# Altium project uCurrentRev5.PrjPcb
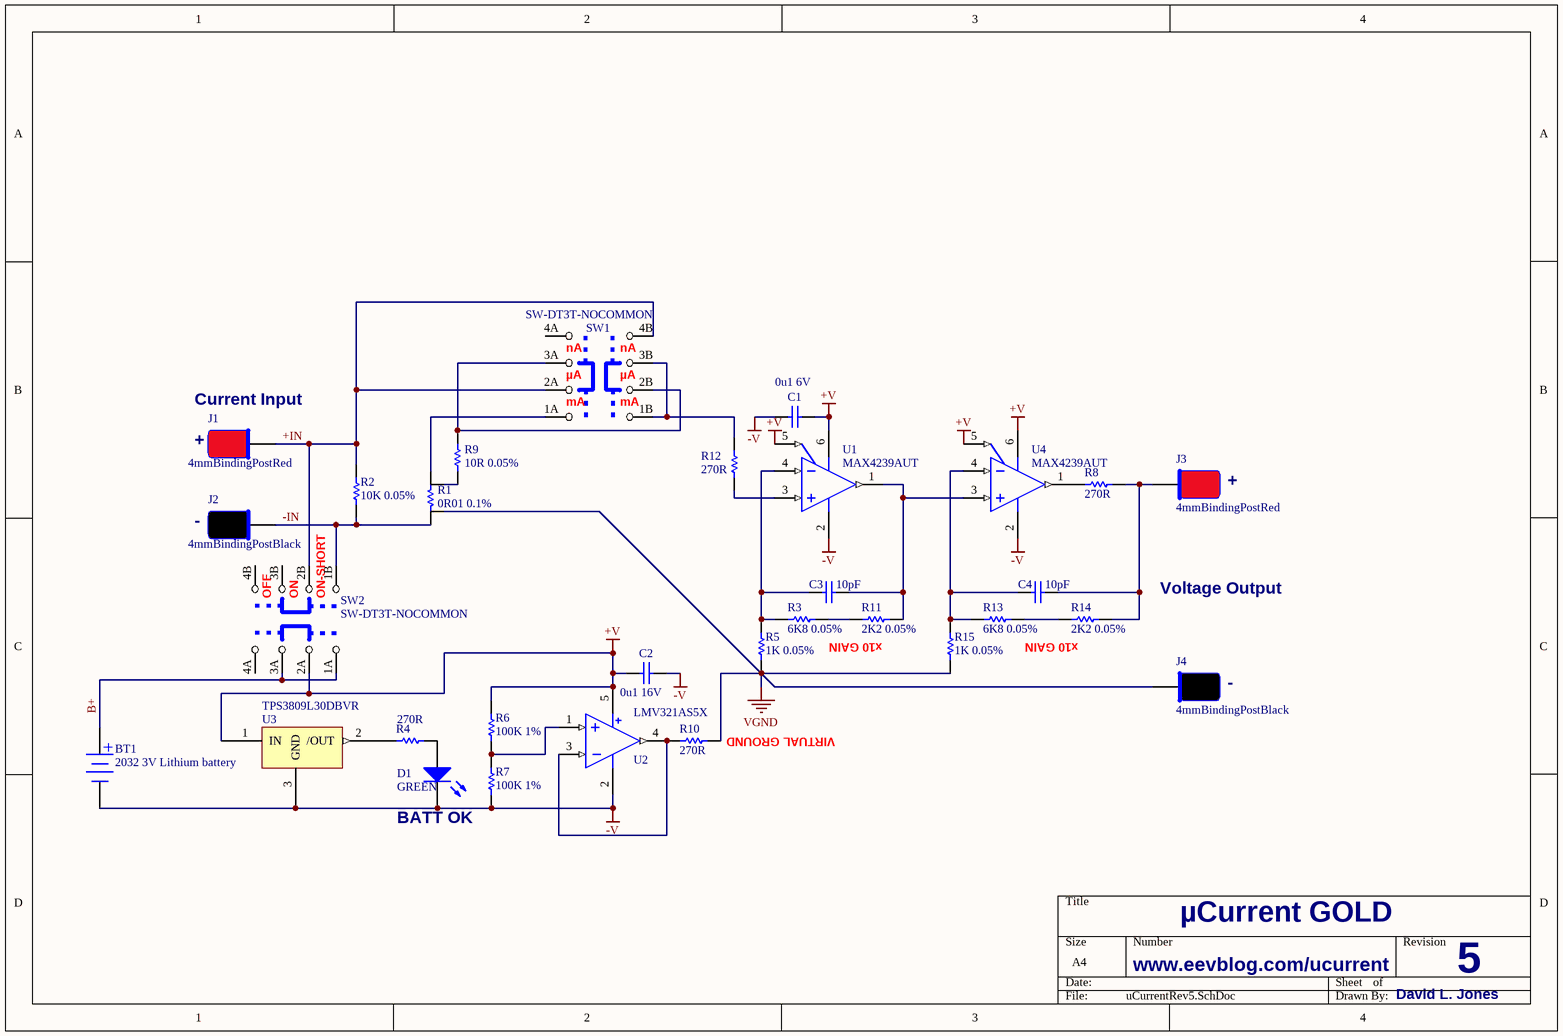
[diagram p0: uCurrentRev5.SchDoc]
1 sheet, 31 parts. Net scope: global (net labels, ports and power ports of the same name join across sheets).
Board files: uCurrentPanelRev5.PcbDoc, uCurrentRev5.PcbDoc

## Sheet uCurrentRev5.SchDoc
size A4

### Parts
BT1  2032 3V Lithium battery  [2032 SMD Holder]
C1  0u1 6V  [CAPC1608N]
C2  0u1 16V  [CAPC1608N]
C3  10pF  [CAPC1608N]
C4  10pF  [CAPC1608N]
D1  GREEN  [1206reverseLED]
J1  4mmBindingPostRed  [4mmBindingPost]
J2  4mmBindingPostBlack  [4mmBindingPost]
J3  4mmBindingPostRed  [4mmBindingPost]
J4  4mmBindingPostBlack  [4mmBindingPost]
R1  0R01 0.1%  [2512shuntresistor]
R2  10K 0.05%  [RESC1608N]
R3  6K8 0.05%  [RESC1608N]
R4  270R  [RESC1608N]
R5  1K 0.05%  [RESC1608N]
R6  100K 1%  [RESC1608N]
R7  100K 1%  [RESC1608N]
R8  270R  [RESC1608N]
R9  10R 0.05%  [RESC2012N]
R10  270R  [RESC1608N]
R11  2K2 0.05%  [RESC1608N]
R12  270R  [RESC1608N]
R13  6K8 0.05%  [RESC1608N]
R14  2K2 0.05%  [RESC1608N]
R15  1K 0.05%  [RESC1608N]
SW1  SW-DT3T-NOCOMMON  [SW_L203011MS02]
SW2  SW-DT3T-NOCOMMON  [SW_L203011MS02]
U1  MAX4239AUT  [SOT-23-CH6_N]
U2  LMV321AS5X  [SOT23-5AL]
U3  TPS3809L30DBVR  [SOT23]
U4  MAX4239AUT  [SOT-23-CH6_N]

### Nets
+V: C1.2 C2.1 R6.2 SW2.2A U1.5(~{CS}) U1.6(VDD) U2.5(V+) U3.1(IN) U4.5(~{CS}) U4.6(VDD)
-V: BT1.2(-) C1.1 C2.2 D1.2(K) R7.2 U1.2(VSS) U2.2 U3.3(GND) U4.2(VSS)
VGND: J4.1(NOISE) R1.4 R5.2 R10.1 R15.2
+IN: J1.1(NOISE) R2.1 SW1.2A SW1.4B SW2.2B(2A)
-IN: J2.1(NOISE) R1.2 R2.2 SW2.1B
B+: BT1.1(+) SW2.1A SW2.3A
NetC3_1: C3.1 R3.1 R5.1 U1.4(VIN-)
NetC3_2: C3.2 R11.2 U1.1(VOUT) U4.3(VIN+)
NetC4_1: C4.1 R13.1 R15.1 U4.4(VIN-)
NetC4_2: C4.2 J3.1(NOISE) R8.1 R14.2
NetD1_1: D1.1(A) R4.1
NetR1_1: R1.1 SW1.1A
NetR1_3: R1.3 R9.2
NetR3_2: R3.2 R11.1
NetR4_2: R4.2 U3.2(/OUT)
NetR6_1: R6.1 R7.1 U2.1(IN+)
NetR8_2: R8.2 U4.1(VOUT)
NetR9_1: R9.1 SW1.2B(2A) SW1.3A
NetR10_2: R10.2 U2.3(IN-) U2.4(OUT)
NetR12_1: R12.1 SW1.1B SW1.3B
NetR12_2: R12.2 U1.3(VIN+)
NetR13_2: R13.2 R14.1

Not connected (* = marked no-connect by the designer): SW1 4A; SW2 3B 4A 4B

### Notes on the sheet
- (near SW1) nA
- (near SW1) µA
- (near J1) +
- (near J1) Current Input
- (near SW1) mA
- (near J3) +
- (near J2) -
- (near SW2) OFF
- (near SW2) ON
- (near SW2) ON-SHORT
- x10 GAIN
- Voltage Output
- (near J4) -
- (near R10) VIRTUAL GROUND
- BATT OK
- µCurrent GOLD
- www.eevblog.com/ucurrent
- 5
- David L. Jones

### Library data of the parts
BT1 = D-302-0000: Lithium Battery Holder for CR2032 3V Cell; Mounting Technology: Through-Hole; Nominal output Voltage: 3 V; Status: Production; Category: Battery
C1-C4 = D-101-0085: Capacitor, Ceramic, 4.7uF 10% 16V 0805 (2012) X7R; Polarity: Non-Polarized; Capacitance: 4.7 uF; Dielectric: X7R; Mounting Technology: Surface Mount; Rated Voltage: 16 V; Status: Unreleased; Technology: None; Tolerance: 10 %; Category: Capacitor
D1 = D-153-0003: LED, Red 0805 (2012) HSMH-C170; Brightness: 17.0 mcd; Peak Wave Length: 639 nm; Color: Red; Mounting Technology: Surface Mount; Status: Production; Category: LED
R1 = 1206currentShunt: 1206 current shunt
R2-R15 = D-100-0004: Resistor, 75R 1% 0805 (2012); Power Rating: 125 mW; Mounting Technology: Surface Mount; Resistance: 75 R; Status: Production; Tolerance: 1 %; Category: Resistor
U1 U4 = MCP6273T-E/CH: 170 uA, 2 MHz Rail-to-Rail Operational Amplifier, 6-Pin SOT-23, Extended Temperature, Tape and Reel; Published: 29-Jan-2009; DatasheetVersion: revF, Mar-2008; PackageVersion: revBB, Aug-2009; PackageReference: SOT-23-CH6; Publisher: Altium Limited; PackageDescription: 6-Lead Plastic Small Outline Transistor (CH) [SOT-23]; Supplier 1: Digi-Key; Supplier Part Number 1: MCP6273T-E/CHTR-ND; Supplier 2: Digi-Key; Supplier Part Number 2: MCP6273T-E/CHCT-ND; Supplier 3: Digi-Key; Supplier Part Number 3: MCP6273T-E/CHDKR-ND; Code_IPC: SOT26A-6; ComponentLink1Description: Datasheet; ComponentLink1URL: http://ww1.microchip.com/downloads/en/DeviceDoc/21810f.pdf; ComponentLink2Description: Packaging Specification; ComponentLink2URL: http://www.microchip.com/stellent/groups/techpub_sg/documents/packagingspec/en012702.pdf; ComponentLink3Description: Microchip.com Home; ComponentLink3URL: http://www.microchip.com/
U2 = LMV321: 2.7V GP Opamp; Published: 23-Sep-2002; LatestRevisionDate: 13-Apr-2006; LatestRevisionNote: IPC-7351 Footprint Added.; DatasheetVersion: Rev 2; 9/96; PackageReference: NSO8; Publisher: Altium Limited; PackageDescription: 8-Pin Small Outline Integrated Circuit 1.27 mm Pitch; Code_JEDEC: MS-012-AA; Code_IPC: SOIC127P600-8; ComponentLink1Description: Manufacturer Link; ComponentLink1URL: http://www.maxim-ic.com/; ComponentLink2Description: Datasheet; ComponentLink2URL: http://pdfserv.maxim-ic.com/en/ds/MAX492-MAX495.pdf
U3 = VoltageSupervisor